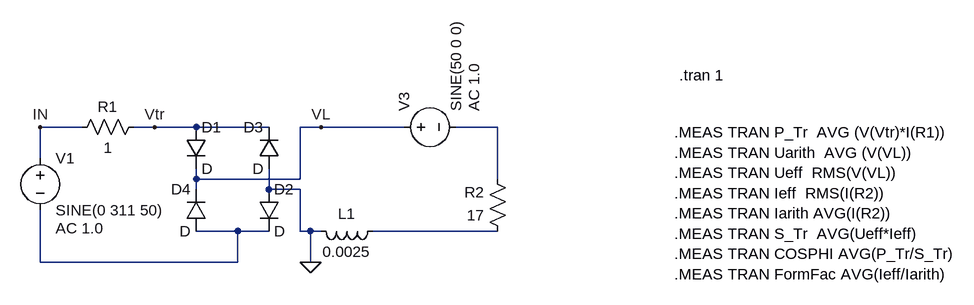
[diagram p0: schematic BrueckeGrMot.asc]
BrueckeGrMot.asc, the LTspice schematic file:
Version 4
SHEET 1 1124 680
WIRE -304 240 -368 240
WIRE -192 240 -224 240
WIRE -128 240 -192 240
WIRE -16 240 -128 240
WIRE 64 240 32 240
WIRE 192 240 64 240
WIRE 336 240 272 240
WIRE -368 288 -368 240
WIRE -128 320 -128 304
WIRE 32 320 32 240
WIRE 32 320 -128 320
WIRE 336 320 336 240
WIRE -128 336 -128 320
WIRE -16 336 -16 304
WIRE 32 336 -16 336
WIRE -64 400 -128 400
WIRE -16 400 -64 400
WIRE 32 400 32 336
WIRE 48 400 32 400
WIRE 64 400 48 400
WIRE 336 400 144 400
WIRE -368 448 -368 368
WIRE -64 448 -64 400
WIRE -64 448 -368 448
WIRE 48 448 48 400
FLAG -368 240 IN
FLAG -192 240 Vtr
FLAG 64 240 VL
FLAG 48 448 0
SYMBOL voltage -368 272 R0
WINDOW 123 24 124 Left 2
WINDOW 39 0 0 Left 2
SYMATTR Value2 AC 1.0
SYMATTR InstName V1
SYMATTR Value SINE(0 311 50)
SYMBOL res -208 224 R90
WINDOW 0 0 56 VBottom 2
WINDOW 3 32 56 VTop 2
SYMATTR InstName R1
SYMATTR Value 1
SYMBOL diode -144 240 R0
SYMATTR InstName D1
SYMBOL res 352 416 R180
WINDOW 0 36 76 Left 2
WINDOW 3 36 40 Left 2
SYMATTR InstName R2
SYMATTR Value 17
SYMBOL diode -32 336 R0
SYMATTR InstName D2
SYMBOL diode 0 304 R180
WINDOW 0 24 64 Left 2
WINDOW 3 24 0 Left 2
SYMATTR InstName D3
SYMBOL diode -112 400 R180
WINDOW 0 24 64 Left 2
WINDOW 3 24 0 Left 2
SYMATTR InstName D4
SYMBOL ind 160 384 R90
WINDOW 0 5 56 VBottom 2
WINDOW 3 32 56 VTop 2
SYMATTR InstName L1
SYMATTR Value 0.0025
SYMBOL voltage 176 240 R270
WINDOW 123 24 124 Left 2
WINDOW 39 0 0 Left 2
SYMATTR Value2 AC 1.0
SYMATTR InstName V3
SYMATTR Value SINE(50 0 0)
TEXT 608 248 Left 2 !.MEAS TRAN P_Tr  AVG (V(Vtr)*I(R1))\n.MEAS TRAN Uarith  AVG (V(VL))\n.MEAS TRAN Ueff  RMS(V(VL))\n.MEAS TRAN Ieff  RMS(I(R2))\n.MEAS TRAN Iarith AVG(I(R2))\n.MEAS TRAN S_Tr  AVG(Ueff*Ieff)\n.MEAS TRAN COSPHI AVG(P_Tr/S_Tr)\n.MEAS TRAN FormFac AVG(Ieff/Iarith)
TEXT 616 160 Left 2 !.tran 1

The netlist it stands for:
* BrueckeGrMot.asc
V1 IN N002 SINE(0 311 50) AC 1.0
R1 Vtr IN 1
D1 Vtr VL D
R2 N003 N001 17
D2 0 N002 D
D3 0 Vtr D
D4 N002 VL D
L1 N003 0 0.0025
V3 VL N001 SINE(50 0 0) AC 1.0
.model D D
.lib standard.dio
.MEAS TRAN P_Tr  AVG (V(Vtr)*I(R1))
.MEAS TRAN Uarith  AVG (V(VL))
.MEAS TRAN Ueff  RMS(V(VL))
.MEAS TRAN Ieff  RMS(I(R2))
.MEAS TRAN Iarith AVG(I(R2))
.MEAS TRAN S_Tr  AVG(Ueff*Ieff)
.MEAS TRAN COSPHI AVG(P_Tr/S_Tr)
.MEAS TRAN FormFac AVG(Ieff/Iarith)
.tran 1
.backanno
.end

* Results of the author's LTspice run, read from the files saved beside the schematic
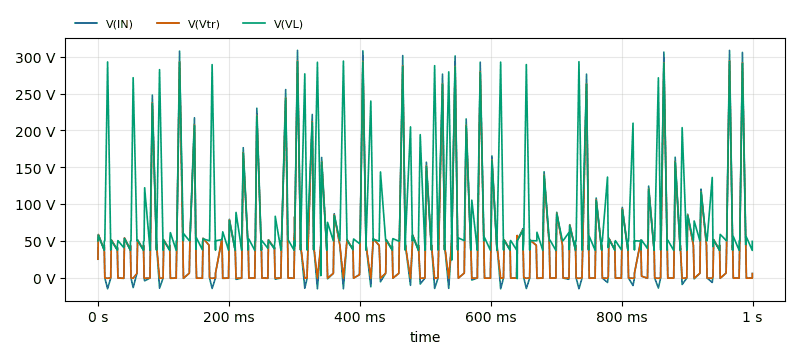
[diagram p1: Transient Analysis of BrueckeGrMot.asc, plotted from the saved traces]
* Transient Analysis, 1 run:
*   V(IN): min -15.23 V, max 309.3 V, average 93.75 V, rms 153.4 V, last 25 V
*   V(Vtr): min -1.484 V, max 295 V, average 93.75 V, rms 146.5 V, last 25 V
*   V(VL): min -40.69 V, max 294.1 V, average 187.5 V, rms 206.5 V, last 50 V
* From the log:
*   p_tr: AVG(v(vtr)*i(r1))=-973.933 FROM 0 TO 1
*   uarith: AVG(v(vl))=187.504 FROM 0 TO 1
*   ueff: RMS(v(vl))=205.733 FROM 0 TO 1
*   ieff: RMS(i(r2))=9.48237 FROM 0 TO 1
*   iarith: AVG(i(r2))=-8.08613 FROM 0 TO 1
*   s_tr: AVG(ueff*ieff)=1950.84 FROM 0 TO 1
*   cosphi: AVG(p_tr/s_tr)=-0.499239 FROM 0 TO 1
*   formfac: AVG(ieff/iarith)=-1.17267 FROM 0 TO 1